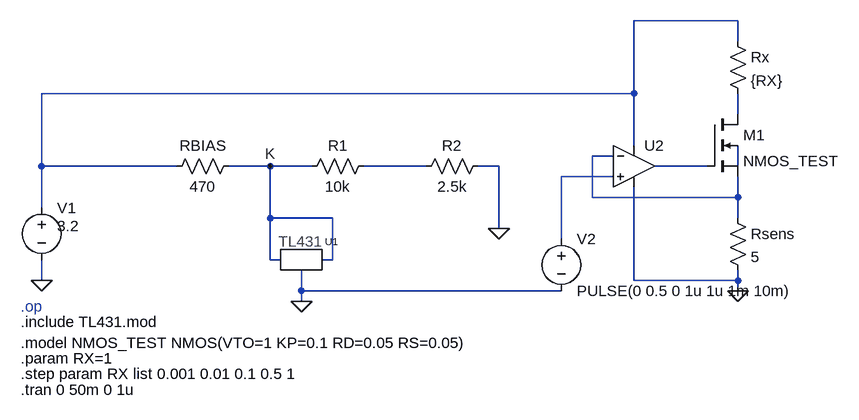
[diagram p0: schematic fuente_corriente.asc]
fuente_corriente.asc, the LTspice schematic file:
Version 4.1
SHEET 1 1224 680
WIRE 704 -96 544 -96
WIRE 704 -64 704 -96
WIRE 544 16 544 -96
WIRE 544 16 -368 16
WIRE 704 48 704 16
WIRE 544 96 544 16
WIRE 512 112 480 112
WIRE -368 128 -368 16
WIRE -160 128 -368 128
WIRE -16 128 -80 128
WIRE 48 128 -16 128
WIRE 224 128 128 128
WIRE 336 128 304 128
WIRE 656 128 576 128
WIRE 704 128 704 96
WIRE 512 144 432 144
WIRE 480 176 480 112
WIRE 704 176 704 144
WIRE 704 176 480 176
WIRE -368 192 -368 128
WIRE -16 208 -16 128
WIRE 80 208 -16 208
WIRE 704 208 704 176
WIRE 336 224 336 128
WIRE 432 240 432 144
WIRE -16 272 -16 208
WIRE 0 272 -16 272
WIRE 80 272 80 208
WIRE 80 272 64 272
WIRE -368 304 -368 272
WIRE 544 304 544 160
WIRE 704 304 704 288
WIRE 704 304 544 304
WIRE 32 320 32 288
WIRE 432 320 32 320
WIRE 704 320 704 304
WIRE 32 336 32 320
FLAG 336 224 0
FLAG -16 128 K
FLAG 32 336 0
FLAG -368 304 0
FLAG 704 320 0
SYMBOL res -64 112 R90
WINDOW 0 0 56 VBottom 2
WINDOW 3 32 56 VTop 2
SYMATTR InstName RBIAS
SYMATTR Value 470
SYMBOL res 144 112 R90
WINDOW 0 0 56 VBottom 2
WINDOW 3 32 56 VTop 2
SYMATTR InstName R1
SYMATTR Value 10k
SYMBOL res 320 112 R90
WINDOW 0 0 56 VBottom 2
WINDOW 3 32 56 VTop 2
SYMATTR InstName R2
SYMATTR Value 2.5k
SYMBOL voltage -368 176 R0
WINDOW 3 24 44 Left 2
WINDOW 123 24 124 Left 2
WINDOW 39 0 0 Left 0
SYMATTR InstName V1
SYMATTR Value 3.2
SYMBOL TL431 32 272 R0
SYMATTR InstName U1
SYMBOL OpAmps\\UniversalOpAmp2 544 128 R0
SYMATTR InstName U2
SYMBOL nmos4 656 48 R0
SYMATTR InstName M1
SYMATTR Value NMOS_TEST
SYMBOL res 688 -80 R0
SYMATTR InstName Rx
SYMATTR Value {RX}
SYMBOL res 688 192 R0
SYMATTR InstName Rsens
SYMATTR Value 5
SYMBOL voltage 432 224 R0
WINDOW 123 0 0 Left 0
WINDOW 39 0 0 Left 0
SYMATTR InstName V2
SYMATTR Value PULSE(0 0.5 0 1u 1u 1m 10m)
TEXT -400 344 Left 2 ;.op
TEXT -400 368 Left 2 !.include TL431.mod
TEXT -400 400 Left 2 !.model NMOS_TEST NMOS(VTO=1 KP=0.1 RD=0.05 RS=0.05)
TEXT -400 424 Left 2 !.param RX=1
TEXT -400 448 Left 2 !.step param RX list 0.001 0.01 0.1 0.5 1
TEXT -400 472 Left 2 !.tran 0 50m 0 1u

The netlist it stands for:
* fuente_corriente.asc
RBIAS K N001 470
R1 N004 K 10k
R2 0 N004 2.5k
V1 N001 0 3.2
X§U1 K 0 K TL431  ; pins REF ANODE CATHODE
X§U2 N007 N003 N001 0 N005 level2 Avol=1Meg GBW=10Meg Slew=10Meg Ilimit=25m Rail=0 Vos=0 En=0 Enk=0 In=0 Ink=0 Rin=500Meg  ; pins In+ In- V+ V- OUT
M1 N002 N005 N003 N006 NMOS_TEST
Rx N001 N002 {RX}
Rsens N003 0 5
V2 N007 0 PULSE(0 0.5 0 1u 1u 1m 10m)
.model NMOS NMOS
.model PMOS PMOS
.lib standard.mos
* .op
.include TL431.mod
.model NMOS_TEST NMOS(VTO=1 KP=0.1 RD=0.05 RS=0.05)
.param RX=1
.step param RX list 0.001 0.01 0.1 0.5 1
.tran 0 50m 0 1u
.lib UniversalOpAmp2.lib
.backanno
.end